# Altium schematic sheet F28335_USB_and_Nordic.SchDoc
size Letter; DocumentNumber: 6; SheetNumber: 6; SheetTotal: 9
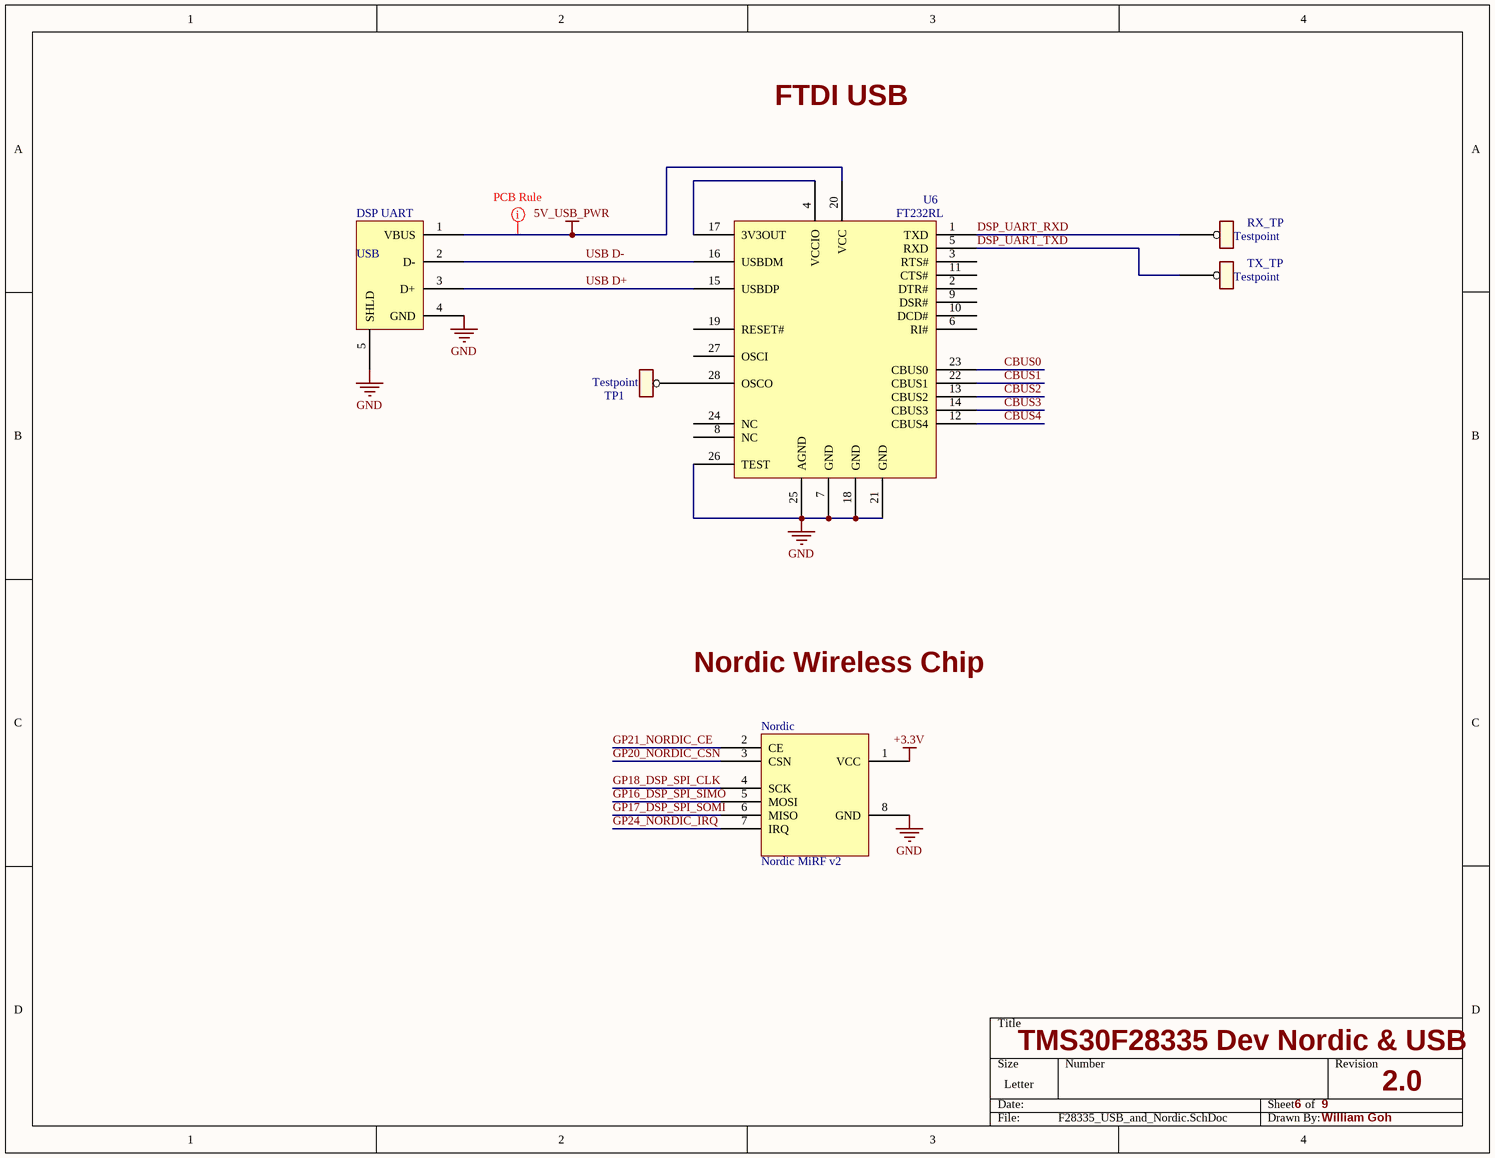
[diagram p0: F28335_USB_and_Nordic.SchDoc]

## Parts
Nordic  Nordic MiRF v2  [Nordic MiRF v2]
RX_TP  Testpoint  [TestPoint Trough-Hole]
TP1  Testpoint  [TestPoint]
TX_TP  Testpoint  [TestPoint Trough-Hole]
U6  FT232RL  [SSOP28]
USB  DSP UART  [USB_TypeB_RightAngle]

## Nets
5V_USB_PWR: U6.20(VCC) USB.1(VBUS)
+3.3V: Nordic.1(VCC)
GND: Nordic.8(GND) U6.7(GND) U6.18(GND) U6.21(GND) U6.25(AGND) U6.26(TEST) USB.4(GND) USB.5(SHLD)
CBUS0: U6.23(CBUS0)
CBUS1: U6.22(CBUS1)
CBUS2: U6.13(CBUS2)
CBUS3: U6.14(CBUS3)
CBUS4: U6.12(CBUS4)
DSP_UART_RXD: RX_TP.1 U6.1(TXD)
DSP_UART_TXD: TX_TP.1 U6.5(RXD)
GP16_DSP_SPI_SIMO: Nordic.5(MOSI)
GP17_DSP_SPI_SOMI: Nordic.6(MISO)
GP18_DSP_SPI_CLK: Nordic.4(SCK)
GP20_NORDIC_CSN: Nordic.3(CSN)
GP21_NORDIC_CE: Nordic.2(CE)
GP24_NORDIC_IRQ: Nordic.7(IRQ)
USB D+: U6.15(USBDP) USB.3(D+)
USB D-: U6.16(USBDM) USB.2(D-)
NetTP1_1: TP1.1 U6.28(OSCO)
NetU6_4: U6.4(VCCIO) U6.17(3V3OUT)

Not connected (* = marked no-connect by the designer): U6 2(DTR#) 3(RTS#) 6(RI#) 8(NC) 9(DSR#) 10(DCD#) 11(CTS#) 19(RESET#) 24(NC) 27(OSCI)

## Layout directives
rule Width Constraint [Pref Width = 20mil    Min Width = 10mil    Max Width = 20mil]: 5V_USB_PWR

## Notes on the sheet
- FTDI USB
- Nordic Wireless Chip
- TMS30F28335 Dev Nordic & USB
- 2.0
- William Goh

## Library data of the parts
U6 = FT232RL: FTDI FT232RL; Digikey #: 768-1007-1-ND
USB = USB: Digikey #: 151-1121-ND